# EAGLE design simple-buffer-with-jacks (EAGLE 7.5.0)
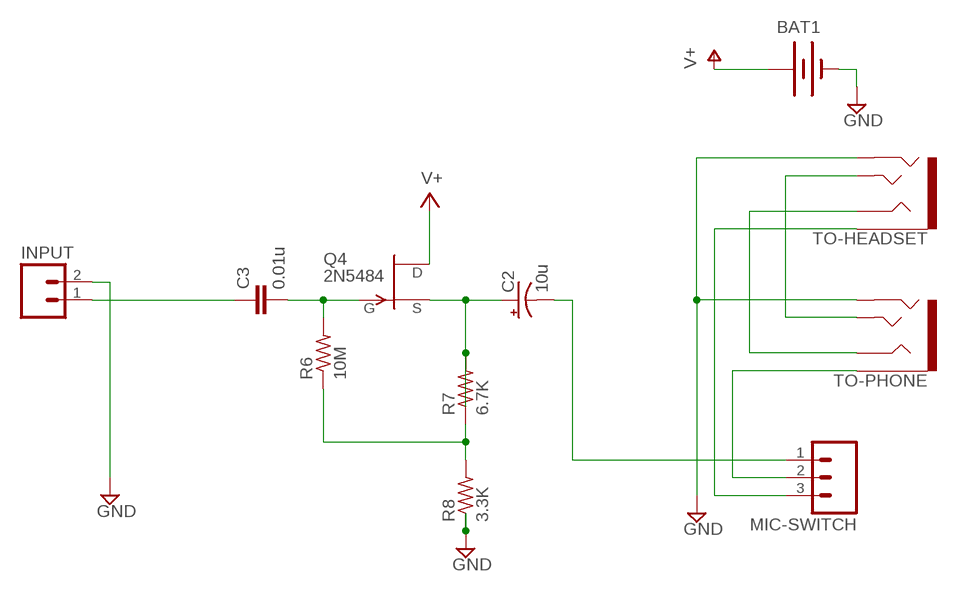
[diagram p0: schematic, sheet 1]

## Parts
BAT1  BATTERYAAA-KIT  [BATTERY-AAA-KIT]
C2  10u  CAP_POLPTH2  [CPOL-RADIAL-10UF-25V]
C3  0.01u  C5/3  [C5B3]
INPUT  M02LOCK  [1X02_LOCK]
MIC-SWITCH  M03LOCK  [1X03_LOCK]
Q4  2N5484  [TO92-]
R6  10M  R-US_0414/5V  [0414V]
R7  6.7K  R-US_0414/5V  [0414V]
R8  3.3K  R-US_0414/5V  [0414V]
TO-HEADSET  AUDIO-JACK3  [AUDIO-JACK-TRRS-SMD]
TO-PHONE  AUDIO-JACK3  [AUDIO-JACK-TRRS-SMD]

## Nets
`DEL: C2.2(-)
GND: BAT1.GND@1(-) INPUT.2 R8.1 TO-HEADSET.RING2 TO-PHONE.RING2
JFET-GATE: C3.2 Q4.1(G) R6.2
JFET-SOURCE: C2.1(+) Q4.2(S) R7.2
N$1: C3.1 INPUT.1
N$7: MIC-SWITCH.3 TO-HEADSET.EARTH
N$8: TO-HEADSET.TIP TO-PHONE.TIP
N$9: TO-HEADSET.RING1 TO-PHONE.RING1
N$10: R6.1 R7.1 R8.2
TO-PHONE: MIC-SWITCH.2 TO-PHONE.EARTH
V+: BAT1.PWR@1(+) Q4.3(D)
Unconnected: MIC-SWITCH.1

## Library data of the parts
BAT1 = Daniel:BATTERY: Battery Holders Various common sizes : AA, AAA, 18650 (PRT-12895), 20mm coin cell and 12mm coin cell. 20MM_4LEGS, BATT-10373; PROD_ID: BATT-08571
C2 = SparkFun-Passives:CAP_POL: Capacitor Polarized These are standard SMD and PTH capacitors. Normally 10uF, 47uF, and 100uF in electrolytic and tantalum varieties. Always verify the external diameter of the through hole cap, it varies with capacity, voltage, and manufacturer. The EIA devices should be standard.
C3 = capacitor-wima:C: CAPACITOR naming: grid - package width
INPUT = CMU-ArtFab:M02: Header 2 Standard 2-pin 0.1" header. Use with straight break away headers (SKU : PRT-00116), right angle break away headers (PRT-00553), swiss pins (PRT-00743), machine pins (PRT-00117), and female headers (PRT-00115). Molex polarized connector foot print use with SKU : PRT-08233 with associated crimp pins and housings.
MIC-SWITCH = SparkFun-Connectors:M03: Header 3 Standard 3-pin 0.1" header. Use with straight break away headers (SKU : PRT-00116), right angle break away headers (PRT-00553), swiss pins (PRT-00743), machine pins (PRT-00117), and female headers (PRT-00115). Molex polarized connector foot print use with SKU : PRT-08232 with associated crimp pins and housings.
Q4 = transistor-fet:?548*: N-Channel JFETs Source: VISHAY 2N5484.pdf Compatible: TO92 2N5245 J304 J305 U310 J308 J309 J310 TO72 2N4416 2N4416A 2N3823 2N4351 3N169 3N170 3N171 MFE3002 TO18 2N3796 2N3797 MFE825 Source: Motorola European Master Guide Pacge 3-59
R6-R8 = resistor:R-US_: RESISTOR, American symbol
TO-HEADSET TO-PHONE = SparkFun-Connectors:AUDIO-JACK3: Audio jack - 3.5mm TRRS variety - two rings.

## Board
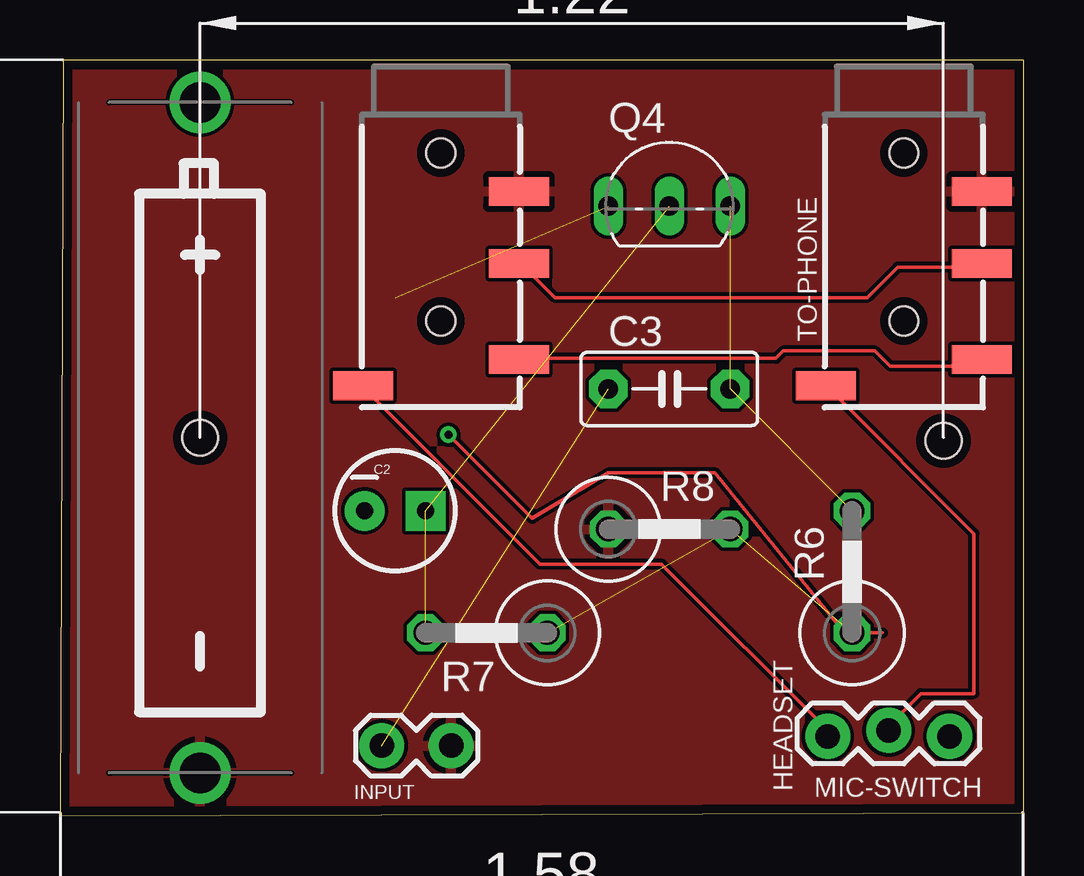
[diagram p1: board, top side]
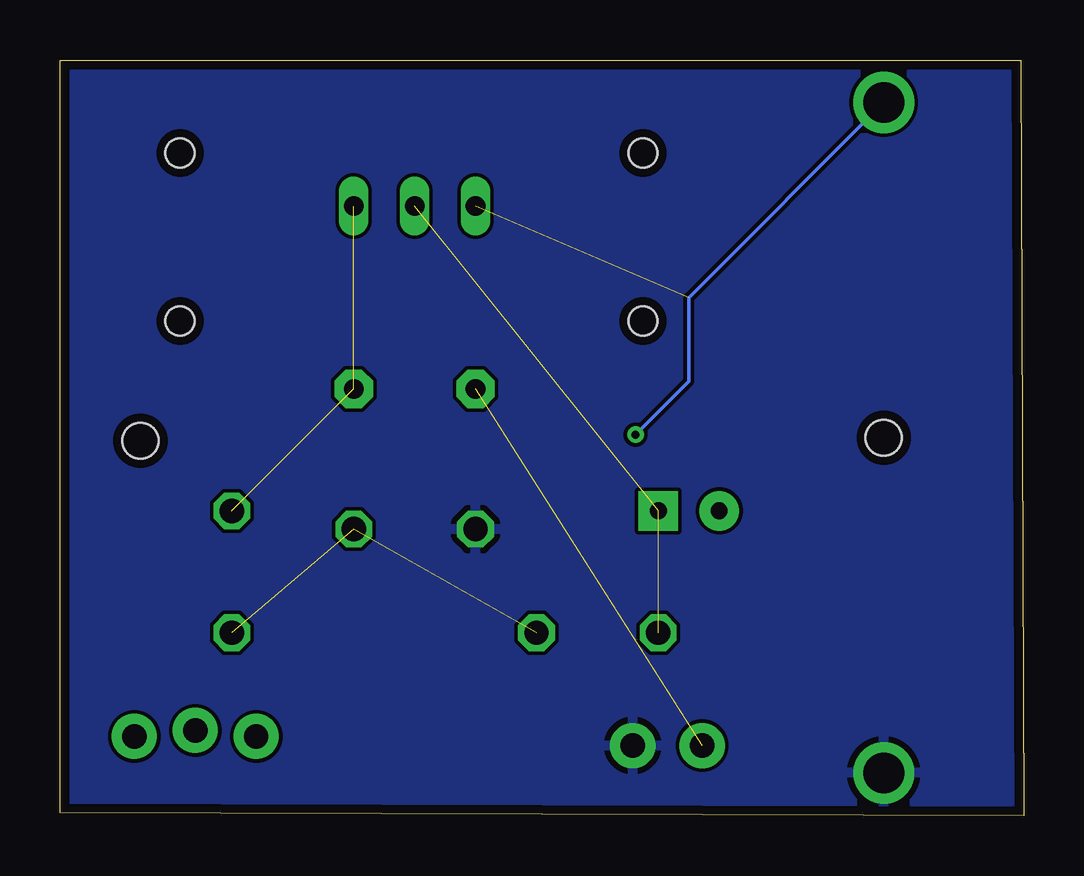
[diagram p2: board, bottom side, seen from below]

Size 40.18 x 31.49 mm. Coordinates in mm from the lower left corner, seen from the top.
Outline: 0,0 40.18,0.13 40.18,31.49 0.13,31.49 0,0
Copper layers (1*16): Top 0.0356mm / dielectric 1.5011mm / Bottom 0.0356mm
Design rules "oshpark-2layer": minimum track width 6mil, minimum drill 13mil, track to track 6mil, track to pad 6mil, pad to pad 6mil, via to via 6mil, smd to smd 6mil, copper to edge 15mil, drill to drill 6mil, minimum pad ring 7mil, minimum via ring 7mil, stop-mask expansion 2.5mil, vias tented up to drill 0mil, thermal gap 10mil
Holes 1.5 mm at 36.83,15.62 5.84,15.75

### Footprints (pad centres in the part's own frame; a part is rotated, then mirrored left to right if it is on the bottom)
BATTERY-AAA-KIT = drill 1.702: GND@1 13.97,0; PWR@1 -13.97,0
CPOL-RADIAL-10UF-25V = drill 0.7 pad 1.651 square: 1 1.27,0 | drill 0.7 pad 1.651: 2 -1.27,0
C5B3 = drill 0.813 pad 1.6 octagon: 1 -2.54,0; 2 2.54,0
1X02_LOCK = drill 1.016 pad 1.88: 1 -0.178,0; 2 2.718,0
1X03_LOCK = drill 1.016 pad 1.88: 1 0,0.127; 2 2.54,-0.127; 3 5.08,0.127
TO92- = drill 0.813 long: 1 2.54,0; 2 0,0; 3 -2.54,0
0414V = drill 1.016 octagon: 1 -2.54,0; 2 2.54,0
AUDIO-JACK-TRRS-SMD = smd 1.2 x 2.5: EARTH 11.3,-3.25; RING1 6.2,3.25; RING2 3.2,3.25; TIP 10.2,3.25 | hole 1.2: 1.6,0; 8.6,0

### Placement (x,y rotation side)
BAT1  5.84,15.75 270 top
C2  13.97,12.7 0 top
C3  25.4,17.78 0 top
INPUT  13.59,2.92 0 top
MIC-SWITCH  37.08,3.43 180 top
Q4  25.4,25.4 0 top
R6  33.02,10.16 90 top
R7  17.78,7.62 180 top
R8  25.4,11.94 0 top
TO-HEADSET  15.88,29.21 270 top
TO-PHONE  35.18,29.21 270 top

### Tracks (layer width: path | path; a pad name or v marks a point on that pad's centre or on a via)
GND
  pour Top: 0,0.13 40.13,0.13 40.13,31.11 0,31.11
  pour Bottom: 0,0.13 40.13,0.13 40.13,31.11 0,31.11
JFET-GATE  (2 unrouted)
JFET-SOURCE  (2 unrouted)
N$1  (1 unrouted)
N$7
  Top 0.152: TO-HEADSET.EARTH 12.7,17.78 20,10.48 25.08,10.48 32.07,3.49 MIC-SWITCH.3
N$8
  Top 0.152: TO-HEADSET.TIP 19.37,19.05 29.84,19.05 30.16,19.37 33.97,19.37 34.61,18.73 38.42,18.73 TO-PHONE.TIP
N$9
  Top 0.152: TO-HEADSET.RING1 19.37,22.86 20.64,21.59 33.66,21.59 34.92,22.86 38.42,22.86 TO-PHONE.RING1
N$10  (2 unrouted)
TO-PHONE
  Top 0.152: TO-PHONE.EARTH 32.07,17.78 38.1,11.75 38.1,5.08 35.88,5.08 34.61,3.81 MIC-SWITCH.2
V+  (via drill 0.33)  (1 unrouted)
  Top 0.152: 34.29,7.62 32.7,7.62 27.3,14.29 22.86,14.29 19.68,12.38 v16.19,15.88
  Bottom 0.152: BAT1.PWR@1 13.97,21.59 13.97,18.1 v16.19,15.88